# Altium project EEM_FMC_Carrier.PrjPCB (part 5 of 9)

## Sheet FPGA_SDRAM.SchDoc: EEM FMC Carrier
size 420 x 297 mm; EDA_Number: ARTIQ; Projet: ARTIQ/Sinara; CheckedBy: -; CompanyName: WUT ISE; DrawnBy: Paweł Kulik; Organization: WUT ISE; Address1: Warsaw University of Technology; Address2: Nowowiejska 15/19 00-665 Warsaw; Address3: pawel.kulik@pw.edu.pl; DocumentNumber: 14; SheetNumber: 5; SheetTotal: 13; ModifiedBy: -; CheckedDate: -; Title2: FPGA SDRAM; DivGrp: ISE; Designer: Paweł Kulik; ModifiedDate: -; ProjectName: EEM_FMC_Carrier.PrjPCB
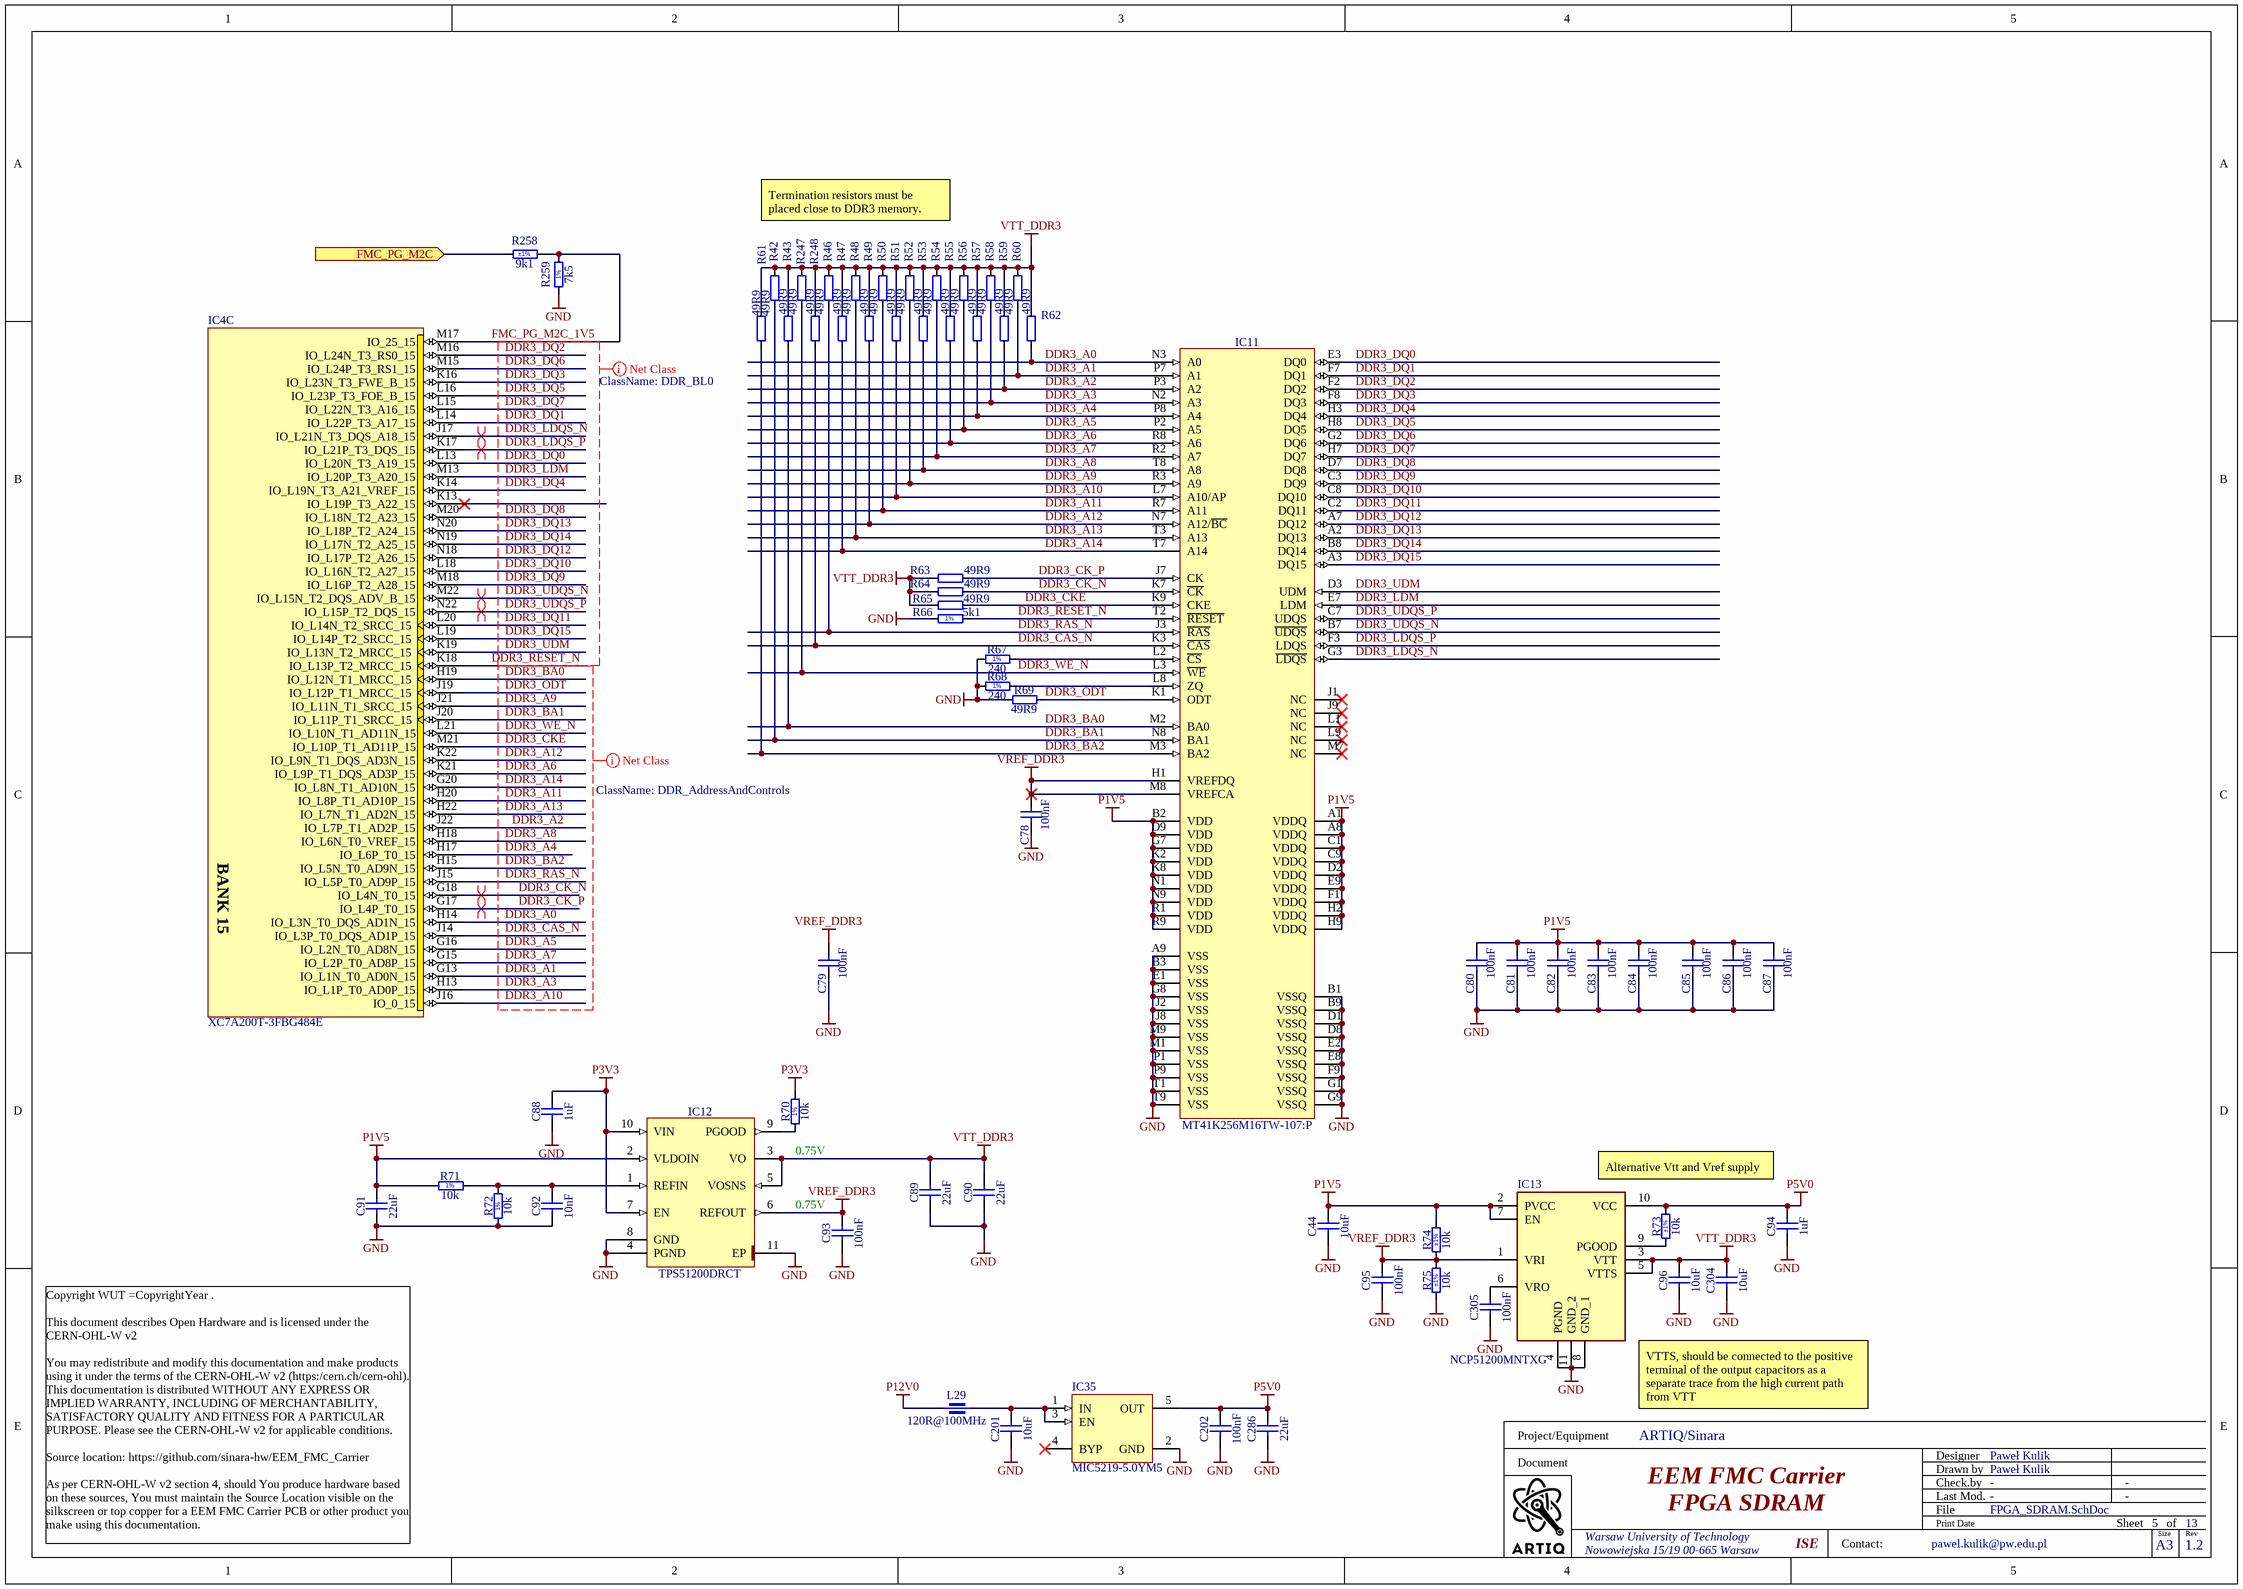
[diagram p7: FPGA_SDRAM.SchDoc]

### Parts
C44  10uF  [CAPC2012X95N]
C78  100nF  [CAPC0603X33N]
C79  100nF  [CAPC0603X33N]
C80  100nF  [CAPC0603X33N]
C81  100nF  [CAPC0603X33N]
C82  100nF  [CAPC0603X33N]
C83  100nF  [CAPC0603X33N]
C84  100nF  [CAPC0603X33N]
C85  100nF  [CAPC0603X33N]
C86  100nF  [CAPC0603X33N]
C87  100nF  [CAPC0603X33N]
C88  1uF  [CAPC1005X55N]
C89  22uF  [CAPC1608X90N]
C90  22uF  [CAPC1608X90N]
C91  22uF  [CAPC1608X90N]
C92  10nF  [CAPC1005X55N]
C93  100nF  [CAPC0603X33N]
C94  1uF  [CAPC1608X87N]
C95  100nF  [CAPC0603X33N]
C96  10uF  [CAPC2012X95N]
C201  10uF  [CAPC2012X95N]
C202  100nF  [CAPC0603X33N]
C286  22uF  [CAPC1608X90N]
C304  10uF  [CAPC2012X95N]
C305  100nF  [CAPC0603X33N]
IC4  XC7A200T-3FBG484E  [BGA484C100P22X22_2300X2300X254]  (part C of 10)
IC11  MT41K256M16TW-107:P  [BGA96C80P9X16_800X1400X120]
IC12  TPS51200DRCT  [TEXAS_DRC (S-PVSON-N10)]
IC13  NCP51200MNTXG  [SON50P300X300X100-11N]
IC35  MIC5219-5.0YM5  [SOT95P280X145-5N]
L29  120R@100MHz  [INDC1608X65N]
R42  49R9  [RESC1005X40N]
R43  49R9  [RESC1005X40N]
R46  49R9  [RESC1005X40N]
R47  49R9  [RESC1005X40N]
R48  49R9  [RESC1005X40N]
R49  49R9  [RESC1005X40N]
R50  49R9  [RESC1005X40N]
R51  49R9  [RESC1005X40N]
R52  49R9  [RESC1005X40N]
R53  49R9  [RESC1005X40N]
R54  49R9  [RESC1005X40N]
R55  49R9  [RESC1005X40N]
R56  49R9  [RESC1005X40N]
R57  49R9  [RESC1005X40N]
R58  49R9  [RESC1005X40N]
R59  49R9  [RESC1005X40N]
R60  49R9  [RESC1005X40N]
R61  49R9  [RESC1005X40N]
R62  49R9  [RESC1005X40N]
R63  49R9  [RESC1005X40N]
R64  49R9  [RESC1005X40N]
R65  49R9  [RESC1005X40N]
R66  5k1  [RESC1005X40N]
R67  240  [RESC1005X40N]
R68  240  [RESC1005X40N]
R69  49R9  [RESC1005X40N]
R70  10k  [RESC1005X40N]
R71  10k  [RESC1005X40N]
R72  10k  [RESC1005X40N]
R73  10k  Tolerance: ±1%  [RESC1005X40N]
R74  10k  Tolerance: ±1%  [RESC1005X40N]
R75  10k  Tolerance: ±1%  [RESC1005X40N]
R247  49R9  [RESC1005X40N]
R248  49R9  [RESC1005X40N]
R258  9k1  Tolerance: ±1%  [RESC1005X40N]
R259  7k5  [RESC1005X40N]

### Ports
FMC_PG_M2C (in)

### Nets
GND: C44.1 C78.1 C79.1 C80.1 C81.1 C82.1 C83.1 C84.1 C85.1 C86.1 C87.1 C88.1 C89.1 C90.1 C91.1 C92.1 C93.1 C94.1 C95.1 C96.1 C201.1 C202.1 C286.1 C304.1 C305.1 IC11.A9(VSS) IC11.B1(VSSQ) IC11.B3(VSS) IC11.B9(VSSQ) IC11.D1(VSSQ) IC11.D8(VSSQ) IC11.E1(VSS) IC11.E2(VSSQ) IC11.E8(VSSQ) IC11.F9(VSSQ) IC11.G1(VSSQ) IC11.G8(VSS) IC11.G9(VSSQ) IC11.J2(VSS) IC11.J8(VSS) IC11.M1(VSS) IC11.M9(VSS) IC11.P1(VSS) IC11.P9(VSS) IC11.T1(VSS) IC11.T9(VSS) IC12.4(PGND) IC12.8(GND) IC12.11(EP) IC13.4(PGND) IC13.8(GND_1) IC13.11(GND_2) IC35.2(GND) R66.1 R67.1 R68.1 R69.1 R72.1 R75.1 R259.1
P1V5: C44.2 C80.2 C81.2 C82.2 C83.2 C84.2 C85.2 C86.2 C87.2 C91.2 IC11.A1(VDDQ) IC11.A8(VDDQ) IC11.B2(VDD) IC11.C1(VDDQ) IC11.C9(VDDQ) IC11.D2(VDDQ) IC11.D9(VDD) IC11.E9(VDDQ) IC11.F1(VDDQ) IC11.G7(VDD) IC11.H2(VDDQ) IC11.H9(VDDQ) IC11.K2(VDD) IC11.K8(VDD) IC11.N1(VDD) IC11.N9(VDD) IC11.R1(VDD) IC11.R9(VDD) IC12.2(VLDOIN) IC13.2(PVCC) IC13.7(EN) R71.1 R74.2
P3V3: C88.2 IC12.7(EN) IC12.10(VIN) R70.2
P5V0: C94.2 C202.2 C286.2 IC13.10(VCC) IC35.5(OUT) R73.2
P12V0: L29.1
VREF_DDR3: C78.2 C79.2 C93.2 C95.2 IC11.H1(VREFDQ) IC11.M8(VREFCA) IC12.6(REFOUT) IC13.1(VRI) R74.1 R75.2
VTT_DDR3: C89.2 C90.2 C96.2 C304.2 IC12.3(VO) IC12.5(VOSNS) IC13.3(VTT) IC13.5(VTTS) R42.2 R43.2 R46.2 R47.2 R48.2 R49.2 R50.2 R51.2 R52.2 R53.2 R54.2 R55.2 R56.2 R57.2 R58.2 R59.2 R60.2 R61.2 R62.2 R63.1 R64.1 R65.1 R247.2 R248.2
DDR3_A0: IC4.H14(IO_L3N_T0_DQS_AD1N_15) IC11.N3(A0) R62.1
DDR3_A1: IC4.G13(IO_L1N_T0_AD0N_15) IC11.P7(A1) R60.1
DDR3_A2: IC4.J22(IO_L7P_T1_AD2P_15) IC11.P3(A2) R59.1
DDR3_A3: IC4.H13(IO_L1P_T0_AD0P_15) IC11.N2(A3) R58.1
DDR3_A4: IC4.H17(IO_L6P_T0_15) IC11.P8(A4) R57.1
DDR3_A5: IC4.G16(IO_L2N_T0_AD8N_15) IC11.P2(A5) R56.1
DDR3_A6: IC4.K21(IO_L9P_T1_DQS_AD3P_15) IC11.R8(A6) R55.1
DDR3_A7: IC4.G15(IO_L2P_T0_AD8P_15) IC11.R2(A7) R54.1
DDR3_A8: IC4.H18(IO_L6N_T0_VREF_15) IC11.T8(A8) R53.1
DDR3_A9: IC4.J21(IO_L11N_T1_SRCC_15) IC11.R3(A9) R52.1
DDR3_A10: IC4.J16(IO_0_15) IC11.L7(A10/AP) R51.1
DDR3_A11: IC4.H20(IO_L8P_T1_AD10P_15) IC11.R7(A11) R50.1
DDR3_A12: IC4.K22(IO_L9N_T1_DQS_AD3N_15) IC11.N7(A12/~{BC}) R49.1
DDR3_A13: IC4.H22(IO_L7N_T1_AD2N_15) IC11.T3(A13) R48.1
DDR3_A14: IC4.G20(IO_L8N_T1_AD10N_15) IC11.T7(A14) R47.1
DDR3_BA0: IC4.H19(IO_L12N_T1_MRCC_15) IC11.M2(BA0) R43.1
DDR3_BA1: IC4.J20(IO_L11P_T1_SRCC_15) IC11.N8(BA1) R42.1
DDR3_BA2: IC4.H15(IO_L5N_T0_AD9N_15) IC11.M3(BA2) R61.1
DDR3_CAS_N: IC4.J14(IO_L3P_T0_DQS_AD1P_15) IC11.K3(~{CAS}) R248.1
DDR3_CK_N: IC4.G18(IO_L4N_T0_15) IC11.K7(~{CK}) R64.2
DDR3_CK_P: IC4.G17(IO_L4P_T0_15) IC11.J7(CK) R63.2
DDR3_CKE: IC4.M21(IO_L10P_T1_AD11P_15) IC11.K9(CKE) R65.2
DDR3_DQ0: IC4.L13(IO_L20N_T3_A19_15) IC11.E3(DQ0)
DDR3_DQ1: IC4.L14(IO_L22P_T3_A17_15) IC11.F7(DQ1)
DDR3_DQ2: IC4.M16(IO_L24N_T3_RS0_15) IC11.F2(DQ2)
DDR3_DQ3: IC4.K16(IO_L23N_T3_FWE_B_15) IC11.F8(DQ3)
DDR3_DQ4: IC4.K14(IO_L19N_T3_A21_VREF_15) IC11.H3(DQ4)
DDR3_DQ5: IC4.L16(IO_L23P_T3_FOE_B_15) IC11.H8(DQ5)
DDR3_DQ6: IC4.M15(IO_L24P_T3_RS1_15) IC11.G2(DQ6)
DDR3_DQ7: IC4.L15(IO_L22N_T3_A16_15) IC11.H7(DQ7)
DDR3_DQ8: IC4.M20(IO_L18N_T2_A23_15) IC11.D7(DQ8)
DDR3_DQ9: IC4.M18(IO_L16P_T2_A28_15) IC11.C3(DQ9)
DDR3_DQ10: IC4.L18(IO_L16N_T2_A27_15) IC11.C8(DQ10)
DDR3_DQ11: IC4.L20(IO_L14N_T2_SRCC_15) IC11.C2(DQ11)
DDR3_DQ12: IC4.N18(IO_L17P_T2_A26_15) IC11.A7(DQ12)
DDR3_DQ13: IC4.N20(IO_L18P_T2_A24_15) IC11.A2(DQ13)
DDR3_DQ14: IC4.N19(IO_L17N_T2_A25_15) IC11.B8(DQ14)
DDR3_DQ15: IC4.L19(IO_L14P_T2_SRCC_15) IC11.A3(DQ15)
DDR3_LDM: IC4.M13(IO_L20P_T3_A20_15) IC11.E7(LDM)
DDR3_LDQS_N: IC4.J17(IO_L21N_T3_DQS_A18_15) IC11.G3(~{LDQS})
DDR3_LDQS_P: IC4.K17(IO_L21P_T3_DQS_15) IC11.F3(LDQS)
DDR3_ODT: IC4.J19(IO_L12P_T1_MRCC_15) IC11.K1(ODT) R69.2
DDR3_RAS_N: IC4.J15(IO_L5P_T0_AD9P_15) IC11.J3(~{RAS}) R46.1
DDR3_RESET_N: IC4.K18(IO_L13P_T2_MRCC_15) IC11.T2(~{RESET}) R66.2
DDR3_UDM: IC4.K19(IO_L13N_T2_MRCC_15) IC11.D3(UDM)
DDR3_UDQS_N: IC4.M22(IO_L15N_T2_DQS_ADV_B_15) IC11.B7(~{UDQS})
DDR3_UDQS_P: IC4.N22(IO_L15P_T2_DQS_15) IC11.C7(UDQS)
DDR3_WE_N: IC4.L21(IO_L10N_T1_AD11N_15) IC11.L3(~{WE}) R247.1
FMC_PG_M2C: R258.1 ; port FMC_PG_M2C
FMC_PG_M2C_1V5: IC4.M17(IO_25_15) R258.2 R259.2
NetC92_2: C92.2 IC12.1(REFIN) R71.2 R72.2
NetC201_2: C201.2 IC35.1(IN) IC35.3(EN) L29.2
NetC305_2: C305.2 IC13.6(VRO)
NetIC11_L2: IC11.L2(~{CS}) R67.2
NetIC11_L8: IC11.L8(ZQ) R68.2
NetIC12_9: IC12.9(PGOOD) R70.1
NetIC13_9: IC13.9(PGOOD) R73.1

Not connected (* = marked no-connect by the designer): IC4 K13(IO_L19P_T3_A22_15)*; IC11 J1(NC)* J9(NC)* L1(NC)* L9(NC)* M7(NC)*; IC35 4(BYP)*

### Layout directives
differential pair; differential pair class Diff_100Ohm; differential pair class Diff_100Ohm: DDR3_CK_N, DDR3_CK_P
differential pair; differential pair class Diff_100Ohm: DDR3_LDQS_N, DDR3_LDQS_P, DDR3_UDQS_N, DDR3_UDQS_P
net class DDR_AddressAndControls; net class 50Ohm: DDR3_A0, DDR3_A1, DDR3_A2, DDR3_A3, DDR3_A4, DDR3_A5, DDR3_A6, DDR3_A7, DDR3_A8, DDR3_A9, DDR3_A10, DDR3_A11, DDR3_A12, DDR3_A13, DDR3_A14, DDR3_BA0, DDR3_BA1, DDR3_BA2, DDR3_CAS_N, DDR3_CK_N, DDR3_CK_P, DDR3_CKE, DDR3_ODT, DDR3_RAS_N, DDR3_WE_N
net class DDR_BL0; net class 50Ohm: DDR3_DQ0, DDR3_DQ1, DDR3_DQ2, DDR3_DQ3, DDR3_DQ4, DDR3_DQ5, DDR3_DQ6, DDR3_DQ7, DDR3_DQ8, DDR3_DQ9, DDR3_DQ10, DDR3_DQ11, DDR3_DQ12, DDR3_DQ13, DDR3_DQ14, DDR3_DQ15, DDR3_LDM, DDR3_LDQS_N, DDR3_LDQS_P, DDR3_UDM, DDR3_UDQS_N, DDR3_UDQS_P

### Notes on the sheet
- Termination resistors must be placed close to DDR3 memory.
- (near R70) 0.75V
- (near C93) 0.75V
- Alternative Vtt and Vref supply
- (near IC13) VTTS, should be connected to the positive terminal of the output capacitors as a separate trace from the high current path from VTT
- Project/Equipment
- Document
- Designer
- Drawn by
- Check.by
- Copyright WUT =CopyrightYear .
  This document describes Open Hardware and is licensed under the CERN-OHL-W v2
  You may redistribute and modify this documentation and make products using it under the terms of the CERN-OHL-W v2 (https:/cern.ch/cern-ohl). This documentation is distributed WITHOUT ANY EXPRESS OR IMPLIED WARRANTY, INCLUDING OF MERCHANTABILITY, SATISFACTORY QUALITY AND FITNESS FOR A PARTICULAR PURPOSE. Please see the CERN-OHL-W v2 for applicable conditions.
  Source location: https://github.com/sinara-hw/EEM_FMC_Carrier
  As per CERN-OHL-W v2 section 4, should You produce hardware based on these sources, You must maintain the Source Location visible on the silkscreen or top copper for a EEM FMC Carrier PCB or other product you make using this documentation.
- Contact:
- File
- Last Mod.
- Print Date
- Sheet
- Size
- A3
- of
- Rev
- (in symbol R0402_5K1_1%_0.0625W_100PPM) 1%
- (in symbol R0402_7K5_1%_0.0625W_100PPM) 1%
- (in symbol R0402_10K_1%_0.0625W_100PPM) 1%
- (in symbol R0402_240R_1%_0.0625W_100PPM) 1%
- (in symbol XC7A200T-3FBG484E, part C) BANK 15

### Library data of the parts
C44 C96 C201 C304 = CC0805_10UF_25V_10%_X5R: Non-polarised capacitor; Part Description: SMD Multilayer Chip Ceramic Capacitor; Manufacturer: GENERIC; Manufacturer1 Part Number: GRM219R61E106KA12D; Voltage: 25V; TC: X5R; Tolerance: ±10%; Part Number: CC0805_10UF_25V_10%_X5R; Component Kind: Standard; Component Type: Standard; Pin Count: 2; Value: 10uF; Status: Preferred; Manufacturer Part Number: CC0805_10UF_25V_10%_X5R; Case: 0805; Mounted: Yes; Socket: No; SMD: Yes; Sense: No; Manufacturer1 Example: MURATA; Manufacturer1 ComponentHeight: 0.95mm; HelpURL: \\cern.ch\dfs\Applications\Altium\Datasheets\CC0805_X5R_MURATA_GRM.pdf; Author: CERN DEM JLC; CreateDate: 25.10.2012; LatestRevisionDate: 06.09.2016
C78-C87 C93 C95 C202 C305 = CC0201_100NF_6.3V_10%_X5R: Non-polarised capacitor; Part Description: SMD Multilayer Chip Ceramic Capacitor; Manufacturer: GENERIC; Manufacturer1 Part Number: 02016D104KAT2A; Voltage: 6.3V; TC: X5R; Tolerance: ±10%; Part Number: CC0201_100NF_6.3V_10%_X5R; Component Kind: Standard; Component Type: Standard; Pin Count: 2; Value: 100nF; Status: Not Recommended; Manufacturer Part Number: CC0201_100NF_6.3V_10%_X5R; Case: 0201; Mounted: Yes; Socket: No; SMD: Yes; Sense: No; Manufacturer1 Example: AVX; Manufacturer1 ComponentHeight: 0.33mm; HelpURL: \\cern.ch\dfs\Applications\Altium\Datasheets\CC0201_X5R_AVX.pdf; Author: CERN DEM JLC
  C78-C87: CreateDate: 2007-12-03; LatestRevisionDate: 2007-12-03
  C93 C95 C202 C305: CreateDate: 03.12.2007; LatestRevisionDate: 03.12.2007
C88 = CC0402_1UF_16V_10%_X5R: Non-polarised capacitor; Part Description: SMD Multilayer Chip Ceramic Capacitor; Manufacturer: GENERIC; Manufacturer1 Part Number: C1005X5R1C105KT; Voltage: 16V; TC: X5R; Tolerance: ±10%; Part Number: CC0402_1UF_16V_10%_X5R; Component Kind: Standard; Component Type: Standard; Pin Count: 2; Value: 1uF; Status: Preferred; Manufacturer Part Number: CC0402_1UF_16V_10%_X5R; Case: 0402; Mounted: Yes; Socket: No; SMD: Yes; Manufacturer1 Example: TDK; Manufacturer1 ComponentHeight: 0.55mm; HelpURL: \\cern.ch\dfs\Applications\Altium\Datasheets\CC0402_X5R_TDK_C.pdf; Author: CERN DEM JLC; CreateDate: 25.10.2012; LatestRevisionDate: 25.10.2012; Sense: No
C89-C91 C286 = CC0603_22UF_6.3V_20%_X5R: Non-polarised capacitor; Part Description: SMD Multilayer Chip Ceramic Capacitor; Manufacturer: GENERIC; Manufacturer1 Part Number: C1608X5R0J226M080; Voltage: 6.3V; TC: X5R; Tolerance: ±20%; Part Number: CC0603_22UF_6.3V_20%_X5R; Component Kind: Standard; Component Type: Standard; Pin Count: 2; Value: 22uF; Status: None; Manufacturer Part Number: CC0603_22UF_6.3V_20%_X5R; Case: 0603; Mounted: Yes; Socket: No; SMD: Yes; Manufacturer1 Example: TDK; Manufacturer1 ComponentHeight: 0.9mm; HelpURL: \\cern.ch\dfs\Applications\Altium\Datasheets\CC0603_X5R_TDK_C.pdf; Author: CERN DEM JLC; CreateDate: 16.12.2013; LatestRevisionDate: 03.12.2020; Sense: No
C92 = CC0402_10NF_16V_10%_X7R: Non-polarised capacitor; Part Description: SMD Multilayer Chip Ceramic Capacitor; Manufacturer: GENERIC; Manufacturer1 Part Number: 223878715636; Voltage: 16V; TC: X7R; Tolerance: ±10%; Part Number: CC0402_10NF_16V_10%_X7R; Component Kind: Standard; Component Type: Standard; Pin Count: 2; Value: 10nF; Status: Not Recommended; Manufacturer Part Number: CC0402_10NF_16V_10%_X7R; Case: 0402; Mounted: Yes; Socket: No; SMD: Yes; Manufacturer1 Example: PHYCOMP; Manufacturer1 ComponentHeight: 0.55mm; HelpURL: \\cern.ch\dfs\Applications\Altium\Datasheets\CC0402_X7R_PHYCOMP.pdf; Author: CERN DEM JLC; CreateDate: 03.12.2007; LatestRevisionDate: 03.12.2007; Sense: No
C94 = CC0603_1UF_25V_10%_X7R: Non-polarised capacitor; Part Description: SMD Multilayer Chip Ceramic Capacitor; Manufacturer: GENERIC; Manufacturer1 Part Number: GRM188R71E105KA12D; Voltage: 25V; TC: X7R; Tolerance: ±10%; Part Number: CC0603_1UF_25V_10%_X7R; Component Kind: Standard; Component Type: Standard; Pin Count: 2; Value: 1uF; Status: None; Manufacturer Part Number: CC0603_1UF_25V_10%_X7R; Case: 0603; Mounted: Yes; Socket: No; SMD: Yes; Sense: No; Manufacturer1 Example: MURATA; Manufacturer1 ComponentHeight: 0.9mm; HelpURL: \\cern.ch\dfs\Applications\Altium\Datasheets\CC0603_X7R_MURATA.pdf; Author: CERN DEM JLC; CreateDate: 18.01.2011; LatestRevisionDate: 18.01.2011
IC4 = XC7A200T-3FBG484E: Artix-7 FPGA, 285 User I/Os, 4 GTP, 484-Ball BGA, Pb-Free; Manufacturer Part Number: XC7A200T-3FBG484E; Device: XC7A200T-3FBG484E
IC11 = MT41K256M16TW-107:P: 32 Meg x 16 x 8 Banks DDR3L SDRAM; Part Description: +1.5V, 4Gb (32Meg x 16 x 8 banks) DDR3L SDRAM; Manufacturer: MICRON TECHNOLOGY; PressFit: No; Bonding: No; Part Number: MT41K256M16TW-107:P; Component Kind: Standard; Component Type: Standard; Device: MT41K256M16TW-107:P; PackageDescription: BGA 0.8mm, Pitch, Square 96 Pin, 9 Columns x 16 Rows, Body 14mm X 8mm X 1.2mm H; Manufacturer Part Number: MT41K256M16TW-107:P; Pin Count: 96; Case: BGA96; Mounted: Yes; Socket: No; SMD: Yes; Sense: No; ComponentHeight: 1.2mm; HelpURL: \\cern.ch\dfs\Applications\Altium\Datasheets\MT41K256M16TW-107-P.pdf; Author: CERN DEM MR; CreateDate: 2015-12-14; LatestRevisionDate: 2015-12-14
IC12 = TPS51200DRCT: Sink/Source DDR Termination Regulator; Part Description: 3.3V Sink/Source DDR Termination Regulator; Manufacturer: TEXAS INSTRUMENTS; PressFit: No; Bonding: No; Part Number: TPS51200DRCT; Component Kind: Standard; Component Type: Standard; Device: TPS51200DRCT; PackageDescription: SON, 0.50mm Pitch, 10-pin, 3.00mm W  X 3.00mm L X 1.00mm Height, (w/thermal tab 1.75 X 2.50 mm); Manufacturer Part Number: TPS51200DRCT; Pin Count: 11; Case: SON10; Mounted: Yes; Socket: No; SMD: Yes; Sense: No; ComponentHeight: 1mm; HelpURL: \\cern.ch\dfs\Applications\Altium\Datasheets\TPS51200DRCT.pdf; Author: CERN DEM JLC; CreateDate: 03.02.2010; LatestRevisionDate: 06.11.2013
IC13 = NCP51200MNTXG: Integrated Circuit; Manufacturer_Name: onsemi; Datasheet Link: http://www.onsemi.com/pub/Collateral/NCP51200-D.PDF; Height: 1mm; Mouser Part Number: 863-NCP51200MNTXG; Mouser Price/Stock: https://www.mouser.co.uk/ProductDetail/onsemi/NCP51200MNTXG?qs=mt7EBqA2jzgnxcGILBvARw%3D%3D; Arrow Part Number: NCP51200MNTXG; Arrow Price/Stock: https://www.arrow.com/en/products/ncp51200mntxg/on-semiconductor?region=nac; Manufacturer Part Number: NCP51200MNTXG
IC35 = MIC5219-5.0YM5: 500mA-Peak Output LDO Regulator 5.0V; Manufacturer: Microchip; Manufacturer Part Number: MIC5219-5.0YM5; Device: MIC5219-5.0YM5
L29 = IND0603_MURATA_BLM18SG121TN1D: Part Description: SMD EMIFIL Suppression Chip Ferrite Bead; Manufacturer: MURATA; Power: 3A; Resistance: 0.025R; Tolerance: ±25%; Part Number: IND0603_MURATA_BLM18SG121TN1D; Component Kind: Standard; Component Type: Standard; Pin Count: 2; Value: 120R@100MHz; Status: None; Manufacturer Part Number: BLM18SG121TN1D; Case: 0603; Mounted: Yes; Socket: No; SMD: Yes; Sense: No; ComponentHeight: 0.65mm; HelpURL: \\cern.ch\dfs\Applications\Altium\Datasheets\IND0603_MURATA_BLM18S.pdf; Author: CERN DEM JLC; CreateDate: 23.07.2014; LatestRevisionDate: 25.10.2018
R42 R43 R46-R65 R69 R247 R248 = R0402_49R9_1%_0.0625W_100PPM: Resistor - 1%; Part Description: General Purpose Thick Film Chip Resistor; Manufacturer: GENERIC; Manufacturer1 Part Number: 232270674999L or RC0402FR-0749R9L; TC: ±100ppm/°C; PressFit: No; Part Number: R0402_49R9_1%_0.0625W_100PPM; Component Kind: Standard; Component Type: Standard; Pin Count: 2; Value: 49R9; Status: Not Recommended; Power: 0.0625W; Tolerance: ±1%; Manufacturer Part Number: R0402_49R9_1%_0.0625W_100PPM; Case: 0402; Mounted: Yes; Socket: No; SMD: Yes; Manufacturer1 Example: YAGEO PHYCOMP; Manufacturer1 ComponentHeight: 0.4mm; HelpURL: \\cern.ch\dfs\Applications\Altium\Datasheets\R0402_Phycomp_RC0402.pdf; Author: CERN DEM JLC; CreateDate: 24.10.2012; LatestRevisionDate: 24.10.2012; Sense: No
R66 = R0402_5K1_1%_0.0625W_100PPM: Resistor - 1%; Part Description: General Purpose Thick Film Chip Resistor; Manufacturer: GENERIC; Manufacturer1 Part Number: 232270675102L; TC: ±100ppm/°C; PressFit: No; Part Number: R0402_5K1_1%_0.0625W_100PPM; Component Kind: Standard; Component Type: Standard; Pin Count: 2; Value: 5k1; Status: Not Recommended; Power: 0.0625W; Tolerance: ±1%; Manufacturer Part Number: R0402_5K1_1%_0.0625W_100PPM; Case: 0402; Mounted: Yes; Sense: No; Socket: No; SMD: Yes; Manufacturer1 Example: YAGEO PHYCOMP; Manufacturer1 ComponentHeight: 0.4mm; HelpURL: \\cern.ch\dfs\Applications\Altium\Datasheets\R0402_Phycomp_RC0402.pdf; Author: CERN DEM JLC; CreateDate: 03.12.2007; LatestRevisionDate: 17.10.2012
R67 R68 = R0402_240R_1%_0.0625W_100PPM: Resistor - 1%; Part Description: General Purpose Thick Film Chip Resistor; Manufacturer: GENERIC; Manufacturer1 Part Number: 232270672401L; TC: ±100ppm/°C; PressFit: No; Part Number: R0402_240R_1%_0.0625W_100PPM; Component Kind: Standard; Component Type: Standard; Pin Count: 2; Value: 240; Status: Not Recommended; Power: 0.0625W; Tolerance: ±1%; Manufacturer Part Number: R0402_240R_1%_0.0625W_100PPM; Case: 0402; Mounted: Yes; Sense: No; Socket: No; SMD: Yes; Manufacturer1 Example: YAGEO PHYCOMP; Manufacturer1 ComponentHeight: 0.4mm; HelpURL: \\cern.ch\dfs\Applications\Altium\Datasheets\R0402_Phycomp_RC0402.pdf; Author: CERN DEM JLC; CreateDate: 03.12.2007; LatestRevisionDate: 17.10.2012
R70-R75 = R0402_10K_1%_0.0625W_100PPM: Resistor - 1%; Part Description: General Purpose Thick Film Chip Resistor; Manufacturer: GENERIC; Manufacturer1 Part Number: 232270671003L; TC: ±100ppm/°C; PressFit: No; Part Number: R0402_10K_1%_0.0625W_100PPM; Component Kind: Standard; Component Type: Standard; Pin Count: 2; Value: 10k; Status: Not Recommended; Power: 0.0625W; Manufacturer Part Number: R0402_10K_1%_0.0625W_100PPM; Case: 0402; Mounted: Yes; Socket: No; SMD: Yes; Manufacturer1 Example: YAGEO PHYCOMP; Manufacturer1 ComponentHeight: 0.4mm; HelpURL: \\cern.ch\dfs\Applications\Altium\Datasheets\R0402_Phycomp_RC0402.pdf; Author: CERN DEM JLC; CreateDate: 03.12.2007; LatestRevisionDate: 17.10.2012; Sense: No
  R70-R72: Tolerance: ±1%
R258 = R0402_9K1_1%_0.0625W_100PPM: Resistor - 1%; Part Description: General Purpose Thick Film Chip Resistor; Manufacturer: GENERIC; Manufacturer1 Part Number: 232270679102L; TC: ±100ppm/°C; PressFit: No; Part Number: R0402_9K1_1%_0.0625W_100PPM; Component Kind: Standard; Component Type: Standard; Pin Count: 2; Value: 9k1; Status: Not Recommended; Power: 0.0625W; Manufacturer Part Number: R0402_9K1_1%_0.0625W_100PPM; Case: 0402; Mounted: Yes; Sense: No; Socket: No; SMD: Yes; Manufacturer1 Example: YAGEO PHYCOMP; Manufacturer1 ComponentHeight: 0.4mm; HelpURL: \\cern.ch\dfs\Applications\Altium\Datasheets\R0402_Phycomp_RC0402.pdf; Author: CERN DEM JLC; CreateDate: 2007-12-03; LatestRevisionDate: 2012-10-17
R259 = R0402_7K5_1%_0.0625W_100PPM: Resistor - 1%; Part Description: General Purpose Thick Film Chip Resistor; Manufacturer: GENERIC; Manufacturer1 Part Number: 232270677502L; TC: ±100ppm/°C; PressFit: No; Part Number: R0402_7K5_1%_0.0625W_100PPM; Component Kind: Standard; Component Type: Standard; Pin Count: 2; Value: 7k5; Status: Not Recommended; Power: 0.0625W; Tolerance: ±1%; Manufacturer Part Number: R0402_7K5_1%_0.0625W_100PPM; Case: 0402; Mounted: Yes; Sense: No; Socket: No; SMD: Yes; Manufacturer1 Example: YAGEO PHYCOMP; Manufacturer1 ComponentHeight: 0.4mm; HelpURL: \\cern.ch\dfs\Applications\Altium\Datasheets\R0402_Phycomp_RC0402.pdf; Author: CERN DEM JLC; CreateDate: 03.12.2007; LatestRevisionDate: 17.10.2012

## Sheet JTAG_Flash_Update.SchDoc: EEM FMC Carrier
size 420 x 297 mm; CheckedBy: -; CompanyName: WUT ISE; DrawnBy: Paweł Kulik; Organization: WUT ISE; Address1: Warsaw University of Technology; Address2: Nowowiejska 15/19 00-665 Warsaw; Address3: pawel.kulik@pw.edu.pl; DocumentNumber: 11; SheetNumber: 9; SheetTotal: 13; CheckedDate: -; Title2: JTAG, Flash & update interface; DivGrp: ISE; Designer: Paweł Kulik; EDA_Number: ARTIQ; Projet: ARTIQ/Sinara; ModifiedDate: -; ProjectName: EEM_FMC_Carrier.PrjPCB
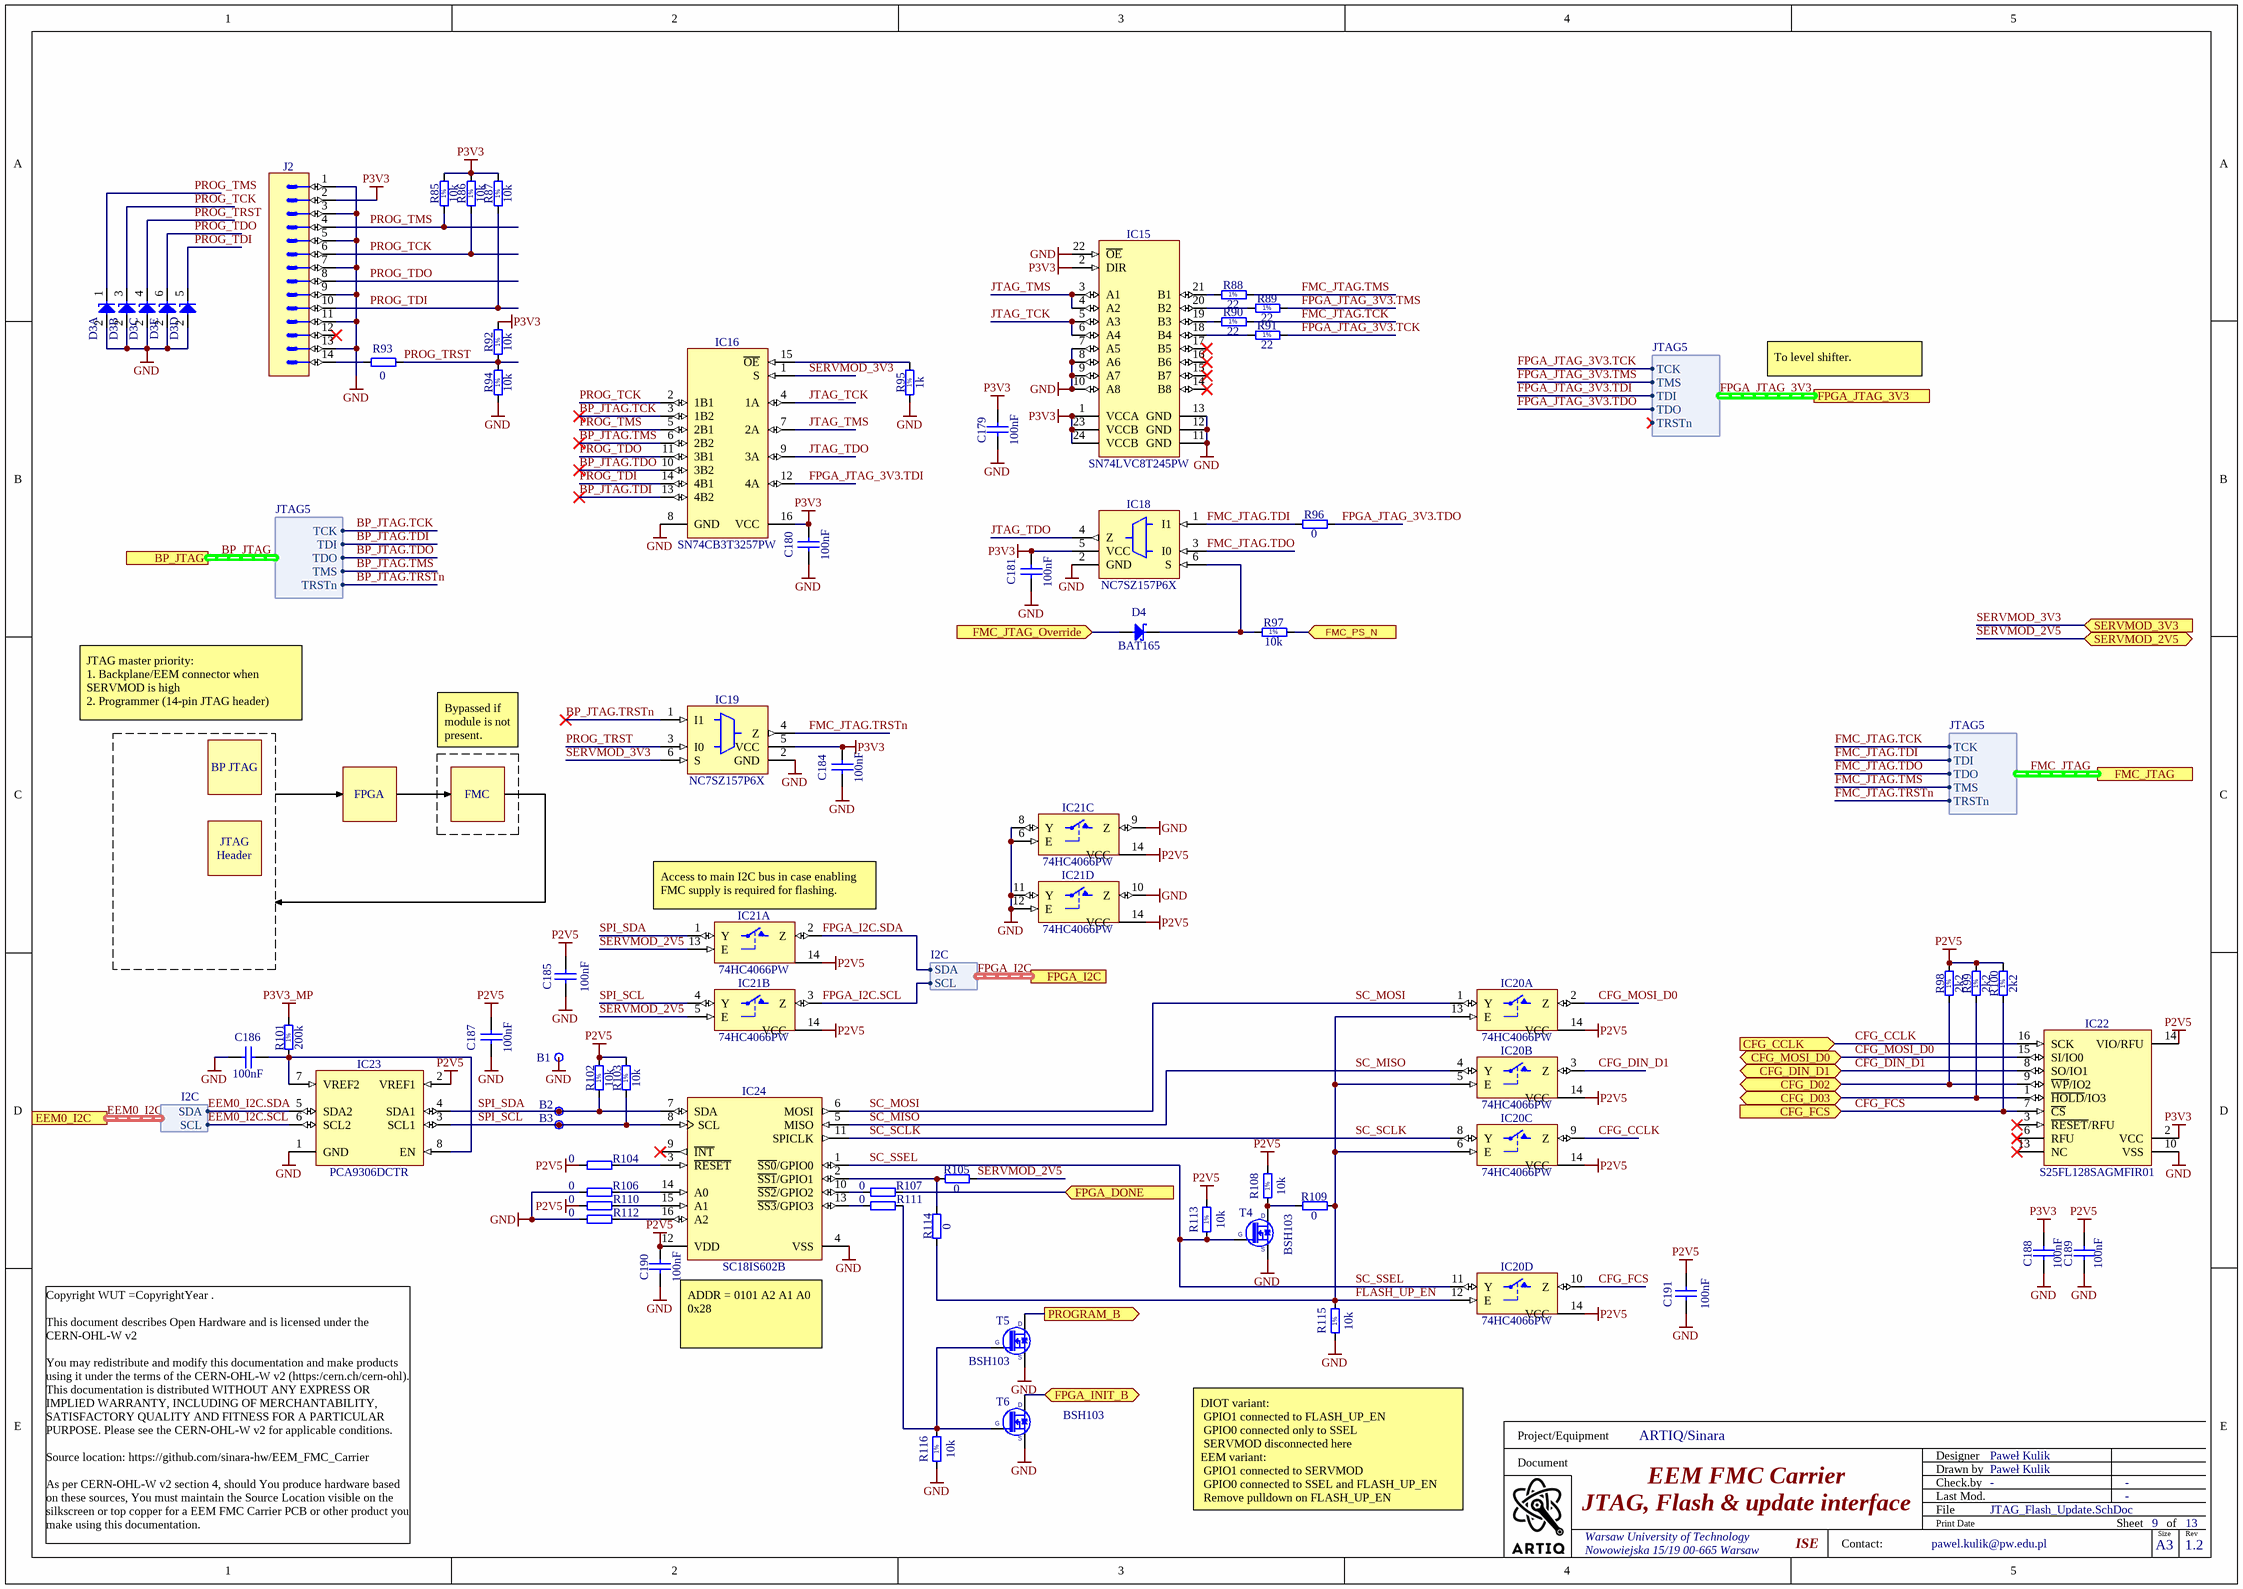
[diagram p8: JTAG_Flash_Update.SchDoc]

### Parts
B1  Plated Hole  [c150h100]  (value not drawn)  (no BOM)
B2  Test Point  [TPS127]  (value not drawn)  (no BOM)
B3  Test Point  [TPS127]  (value not drawn)  (no BOM)
C179  100nF  [CAPC1005X55N]
C180  100nF  [CAPC1005X55N]
C181  100nF  [CAPC1005X55N]
C184  100nF  [CAPC1005X55N]
C185  100nF  [CAPC1005X55N]
C186  100nF  [CAPC1005X55N]
C187  100nF  [CAPC1005X55N]
C188  100nF  [CAPC0603X33N]
C189  100nF  [CAPC0603X33N]
C190  100nF  [CAPC1005X55N]
C191  100nF  [CAPC1005X55N]
D3  PESD3V3L5UY  [SOT65P210X110-6N]  (value not drawn)  (parts A,B,C,D,E of 5)
D4  BAT165  [SOD2512X110N]
IC15  SN74LVC8T245PW  [SOP65P640X120-24N]
IC16  SN74CB3T3257PW  [SOP65P640X120-16N]
IC18  NC7SZ157P6X  [SOT65P210X110-6N]
IC19  NC7SZ157P6X  [SOT65P210X110-6N]
IC20  74HC4066PW  [SOP65P640X110-14N]  (parts A,B,C,D of 4)
IC21  74HC4066PW  [SOP65P640X110-14N]  (parts A,B,C,D of 4)
IC22  S25FL128SAGMFIR01  [SOIC127P1030X265-16N]
IC23  PCA9306DCTR  [SOP65P400X130-8N]
IC24  SC18IS602B  [SOP65P640X110-16N]
J2  Milli-Grid™  [MOLEX_87832-1420]  (value not drawn)
R85  10k  [RESC1005X40N]
R86  10k  [RESC1005X40N]
R87  10k  [RESC1005X40N]
R88  22  [RESC1005X40N]
R89  22  [RESC1005X40N]
R90  22  [RESC1005X40N]
R91  22  [RESC1005X40N]
R92  10k  [RESC1005X40N]
R93  0  [RESC1005X40N]
R94  10k  [RESC1005X40N]
R95  1k  [RESC1005X40N]
R96  0  [RESC1005X40N]
R97  10k  [RESC1005X40N]
R98  2k2  [RESC1005X40N]
R99  2k2  [RESC1005X40N]
R100  2k2  [RESC1005X40N]
R101  200k  [RESC1005X40N]
R102  10k  [RESC1005X40N]
R103  10k  [RESC1005X40N]
R104  0  [RESC1005X40N]
R105  0  [RESC1005X40N]
R106  0  [RESC1005X40N]
R107  0  [RESC1005X40N]
R108  10k  [RESC1005X40N]
R109  0  [RESC1005X40N]
R110  0  [RESC1005X40N]
R111  0  [RESC1005X40N]
R112  0  [RESC1005X40N]
R113  10k  [RESC1005X40N]
R114  0  [RESC1005X40N]
R115  10k  [RESC1005X40N]
R116  10k  [RESC1005X40N]
T4  BSH103  [SOT95P230X110-3N]
T5  BSH103  [SOT95P230X110-3N]
T6  BSH103  [SOT95P230X110-3N]

### Ports
BP_JTAG (harness JTAG5), CFG_CCLK (in), CFG_D02 (bidir), CFG_D03 (bidir), CFG_DIN_D1 (bidir), CFG_FCS (in), CFG_MOSI_D0 (bidir), EEM0_I2C (harness I2C), FMC_JTAG (harness JTAG5), FMC_JTAG_Override (in), FMC_PS_N (in), FPGA_DONE (in), FPGA_I2C (harness I2C), FPGA_INIT_B (bidir), FPGA_JTAG_3V3 (harness JTAG5), PROGRAM_B (out), SERVMOD_2V5 (bidir), SERVMOD_3V3 (in)

### Harnesses
JTAG5: TCK, TDI, TDO, TMS, TRSTn
I2C: SDA, SCL

### Nets
GND: B1.1 C179.1 C180.1 C181.1 C184.1 C185.1 C186.1 C187.1 C188.1 C189.1 C190.1 C191.1 D3.2(A) IC15.7(A5) IC15.8(A6) IC15.9(A7) IC15.10(A8) IC15.11(GND) IC15.12(GND) IC15.13(GND) IC15.22(~{OE}) IC16.8(GND) IC18.2(GND) IC19.2(GND) IC20.7(GND) IC21.6(E) IC21.7(GND) IC21.8(Y) IC21.9(Z) IC21.10(Z) IC21.11(Y) IC21.12(E) IC22.10(VSS) IC23.1(GND) IC24.4(VSS) J2.1 J2.3 J2.5 J2.7 J2.9 J2.11 J2.13 R94.1 R95.1 R106.2 R112.2 R115.1 R116.1 T4.2(S) T5.2(S) T6.2(S)
P2V5: C185.2 C187.2 C189.2 C190.2 C191.2 IC20.14(VCC) IC21.14(VCC) IC22.14(VIO/RFU) IC23.2(VREF1) IC24.12(VDD) R98.2 R99.2 R100.2 R102.2 R103.2 R104.2 R108.2 R110.2 R113.2
P3V3: C179.2 C180.2 C181.2 C184.2 C188.2 IC15.1(VCCA) IC15.2(DIR) IC15.23(VCCB) IC15.24(VCCB) IC16.16(VCC) IC18.5(VCC) IC19.5(VCC) IC22.2(VCC) J2.2 R85.2 R86.2 R87.2 R92.2
P3V3_MP: R101.2
BP_JTAG.TCK: IC16.3(1B2) ; port BP_JTAG.TCK
BP_JTAG.TDI: IC16.13(4B2) ; port BP_JTAG.TDI
BP_JTAG.TDO: IC16.10(3B2) ; port BP_JTAG.TDO
BP_JTAG.TMS: IC16.6(2B2) ; port BP_JTAG.TMS
BP_JTAG.TRSTn: IC19.1(I1) ; port BP_JTAG.TRSTn
CFG_CCLK: IC20.9(Z) IC22.16(SCK) ; port CFG_CCLK
CFG_D02: IC22.9(~{WP}/IO2) R98.1 ; port CFG_D02
CFG_D03: IC22.1(~{HOLD}/IO3) R99.1 ; port CFG_D03
CFG_DIN_D1: IC20.3(Z) IC22.8(SO/IO1) ; port CFG_DIN_D1
CFG_FCS: IC20.10(Z) IC22.7(~{CS}) R100.1 ; port CFG_FCS
CFG_MOSI_D0: IC20.2(Z) IC22.15(SI/IO0) ; port CFG_MOSI_D0
EEM0_I2C.SCL: IC23.6(SCL2) ; port EEM0_I2C.SCL
EEM0_I2C.SDA: IC23.5(SDA2) ; port EEM0_I2C.SDA
FLASH_UP_EN: IC20.5(E) IC20.6(E) IC20.12(E) IC20.13(E) R109.2 R114.1 R115.2
FMC_JTAG.TCK: R90.2 ; port FMC_JTAG.TCK
FMC_JTAG.TDI: IC18.1(I1) R96.2 ; port FMC_JTAG.TDI
FMC_JTAG.TDO: IC18.3(I0) ; port FMC_JTAG.TDO
FMC_JTAG.TMS: R88.2 ; port FMC_JTAG.TMS
FMC_JTAG.TRSTn: IC19.4(Z) ; port FMC_JTAG.TRSTn
FMC_JTAG_Override: D4.2(A) ; port FMC_JTAG_Override
FMC_PS_N: R97.2 ; port FMC_PS_N
FPGA_DONE: R107.1 ; port FPGA_DONE
FPGA_I2C.SCL: IC21.3(Z) ; port FPGA_I2C.SCL
FPGA_I2C.SDA: IC21.2(Z) ; port FPGA_I2C.SDA
FPGA_INIT_B: T6.3(D) ; port FPGA_INIT_B
FPGA_JTAG_3V3.TCK: R91.2 ; port FPGA_JTAG_3V3.TCK
FPGA_JTAG_3V3.TDI: IC16.12(4A) ; port FPGA_JTAG_3V3.TDI
FPGA_JTAG_3V3.TDO: R96.1 ; port FPGA_JTAG_3V3.TDO
FPGA_JTAG_3V3.TMS: R89.2 ; port FPGA_JTAG_3V3.TMS
JTAG_TCK: IC15.5(A3) IC15.6(A4) IC16.4(1A)
JTAG_TDO: IC16.9(3A) IC18.4(Z)
JTAG_TMS: IC15.3(A1) IC15.4(A2) IC16.7(2A)
PROG_TCK: D3.3(C) IC16.2(1B1) J2.6 R86.1
PROG_TDI: D3.5(C) IC16.14(4B1) J2.10 R87.1
PROG_TDO: D3.6(C) IC16.11(3B1) J2.8
PROG_TMS: D3.1(C) IC16.5(2B1) J2.4 R85.1
PROG_TRST: D3.4(C) IC19.3(I0) R92.1 R93.1 R94.2
PROGRAM_B: T5.3(D) ; port PROGRAM_B
SC_MISO: IC20.4(Y) IC24.5(MISO)
SC_MOSI: IC20.1(Y) IC24.6(MOSI)
SC_SCLK: IC20.8(Y) IC24.11(SPICLK)
SC_SSEL: IC20.11(Y) IC24.1(~{SS0}/GPIO0) R113.1 T4.1(G)
SERVMOD_2V5: IC21.5(E) IC21.13(E) R105.2 ; port SERVMOD_2V5
SERVMOD_3V3: IC16.1(S) IC19.6(S) ; port SERVMOD_3V3
SPI_SCL: B3.1 IC21.4(Y) IC23.3(SCL1) IC24.8(SCL) R103.1
SPI_SDA: B2.1 IC21.1(Y) IC23.4(SDA1) IC24.7(SDA) R102.1
NetC186_2: C186.2 IC23.7(VREF2) IC23.8(EN) R101.1
NetD4_1: D4.1(C) IC18.6(S) R97.1
NetIC15_18: IC15.18(B4) R91.1
NetIC15_19: IC15.19(B3) R90.1
NetIC15_20: IC15.20(B2) R89.1
NetIC15_21: IC15.21(B1) R88.1
NetIC16_15: IC16.15(~{OE}) R95.2
NetIC24_2: IC24.2(~{SS1}/GPIO1) R105.1 R114.2
NetIC24_3: IC24.3(~{RESET}) R104.1
NetIC24_10: IC24.10(~{SS2}/GPIO2) R107.2
NetIC24_13: IC24.13(~{SS3}/GPIO3) R111.2
NetIC24_14: IC24.14(A0) R106.1
NetIC24_15: IC24.15(A1) R110.1
NetIC24_16: IC24.16(A2) R112.1
NetJ2_14: J2.14 R93.2
NetR108_1: R108.1 R109.1 T4.3(D)
NetR111_1: R111.1 R116.2 T5.1(G) T6.1(G)

Not connected (* = marked no-connect by the designer): IC15 14(B8)* 15(B7)* 16(B6)* 17(B5)*; IC22 3(~{RESET}/RFU)* 6(RFU)* 13(NC)*; IC24 9(~{INT})*; J2 12*

### Buses and harness runs
harness BP_JTAG = port BP_JTAG
harness EEM0_I2C = port EEM0_I2C
harness FMC_JTAG = port FMC_JTAG
harness FPGA_I2C = port FPGA_I2C
harness FPGA_JTAG_3V3 = port FPGA_JTAG_3V3

### Notes on the sheet
- To level shifter.
- JTAG master priority:
  1. Backplane/EEM connector when SERVMOD is high
  2. Programmer (14-pin JTAG header)
- BP JTAG
- FPGA
- Bypassed if module is not present.
- FMC
- JTAG
- Header
- (near IC21) Access to main I2C bus in case enabling FMC supply is required for flashing.
- ADDR = 0101 A2 A1 A0
  0x28
- DIOT variant:
  GPIO1 connected to FLASH_UP_EN
  GPIO0 connected only to SSEL
  SERVMOD disconnected here
  EEM variant:
  GPIO1 connected to SERVMOD
  GPIO0 connected to SSEL and FLASH_UP_EN
  Remove pulldown on FLASH_UP_EN
- Project/Equipment
- Document
- Designer
- Drawn by
- Check.by
- Copyright WUT =CopyrightYear .
  This document describes Open Hardware and is licensed under the CERN-OHL-W v2
  You may redistribute and modify this documentation and make products using it under the terms of the CERN-OHL-W v2 (https:/cern.ch/cern-ohl). This documentation is distributed WITHOUT ANY EXPRESS OR IMPLIED WARRANTY, INCLUDING OF MERCHANTABILITY, SATISFACTORY QUALITY AND FITNESS FOR A PARTICULAR PURPOSE. Please see the CERN-OHL-W v2 for applicable conditions.
  Source location: https://github.com/sinara-hw/EEM_FMC_Carrier
  As per CERN-OHL-W v2 section 4, should You produce hardware based on these sources, You must maintain the Source Location visible on the silkscreen or top copper for a EEM FMC Carrier PCB or other product you make using this documentation.
- Contact:
- File
- Last Mod.
- Print Date
- Sheet
- Size
- A3
- of
- Rev
- (in symbol R0402_1K_1%_0.0625W_100PPM) 1%
- (in symbol R0402_2K2_1%_0.0625W_100PPM) 1%
- (in symbol R0402_10K_1%_0.0625W_100PPM) 1%
- (in symbol R0402_22R_1%_0.0625W_100PPM) 1%
- (in symbol R0402_200K_1%_0.0625W_100PPM) 1%

### Library data of the parts
B1 = PLATED_HOLE1.0_PAD1.5: Single Terminal Socket; Part Description: Plated Through Hole: Hole Dia.=1mm Pad Dia.=1.5mm,  IPC-7251 Level C; Mounted: No; Part Number: PLATED_HOLE1.0_PAD1.5; Component Type: Standard (No BOM); Pin Count: 1; Family: Plated Hole; Socket: No; SMD: No; Sense: No; Status: None; ComponentHeight: 0mm; HelpURL: Undefined; Author: CERN DEM JLC; CreateDate: 30.10.2008; LatestRevisionDate: 30.10.2008; PackageDescription: Plated Through Hole: Hole Dia.=1mm Pad Dia.=1.5mm,  IPC-7251 Level C
B2 B3 = SMD_PAD_1.27X1.27MM: Part Description: 1.27mm x 1.27mm PCB Copper Area (SMD Test Point); Mounted: No; Part Number: SMD_PAD_1.27X1.27MM; Component Type: Standard (No BOM); Pin Count: 1; Family: Test Point; Socket: No; SMD: No; Sense: No; Status: None; ComponentHeight: 0mm; HelpURL: Undefined; Author: CERN DEM JLC; CreateDate: 12.01.2008; LatestRevisionDate: 12.01.2008; PackageDescription: 1.27mm x 1.27mm PCB Copper Area (SMD Test Point)
C179-C181 C184 C186 C187 = CC0402_100NF_25V_10%_X7R_YUDEN_TMK105B7104KVHF: Non-polarised capacitor; Part Description: SMD Multilayer Chip Ceramic Capacitor (High Dielectric Type) for Automotive / Industrial Applications; Manufacturer: TAIYO YUDEN; Voltage: 25V; TC: X7R; Tolerance: ±10%; Part Number: CC0402_100NF_25V_10%_X7R_YUDEN_TMK105B7104KVHF; Component Kind: Standard; Component Type: Standard; Pin Count: 2; Value: 100nF; Status: Not Recommended; Manufacturer Part Number: TMK105B7104KVHF; Case: 0402; Mounted: Yes; Socket: No; SMD: Yes; Sense: No; HelpURL: \\cern.ch\dfs\Applications\Altium\Datasheets\CC0402_TAIYO-YUDEN_TMK105B7104KVHF.pdf; Author: CERN DEM JLC; CreateDate: 10-May-17; LatestRevisionDate: 10-May-17; ComponentHeight: 0.55mm
C185 C190 C191 = CC0402_100NF_16V_10%_X5R: Non-polarised capacitor; Part Description: SMD Multilayer Chip Ceramic Capacitor; Manufacturer: GENERIC; Manufacturer1 Part Number: GRM155R61C104KA88D; Voltage: 16V; TC: X5R; Tolerance: ±10%; Part Number: CC0402_100NF_16V_10%_X5R; Component Kind: Standard; Component Type: Standard; Pin Count: 2; Value: 100nF; Status: None; Manufacturer Part Number: CC0402_100NF_16V_10%_X5R; Case: 0402; Mounted: Yes; Socket: No; SMD: Yes; Sense: No; Manufacturer1 Example: MURATA; Manufacturer1 ComponentHeight: 0.55mm; HelpURL: \\cern.ch\dfs\Applications\Altium\Datasheets\CC0402_X5R_MURATA_GRM.pdf; Author: CERN DEM JLC; CreateDate: 10.12.2013; LatestRevisionDate: 10.12.2013
C188 C189 = CC0201_100NF_6.3V_10%_X5R: as C78-C87 on sheet FPGA_SDRAM; Part Number: CC0201_100NF_6.3V_10%_X5R; Component Kind: Standard; Component Type: Standard; Pin Count: 2; Value: 100nF; Status: Not Recommended; Manufacturer Part Number: CC0201_100NF_6.3V_10%_X5R; Case: 0201; Mounted: Yes; Socket: No; SMD: Yes; Sense: No; Manufacturer1 Example: AVX; Manufacturer1 ComponentHeight: 0.33mm; HelpURL: \\cern.ch\dfs\Applications\Altium\Datasheets\CC0201_X5R_AVX.pdf; Author: CERN DEM JLC; CreateDate: 03.12.2007; LatestRevisionDate: 03.12.2007; ClassName: Artix
D3 = PESD3V3L5UY: Fivefold ESD Protection Diode Arrays; Part Description: Fivefold ESD Protection Diode Arrays (30kV); Manufacturer: NEXPERIA; Voltage: 3.3V; Power: 200W; PressFit: No; Bonding: No; Part Number: PESD3V3L5UY; Component Kind: Standard; Component Type: Standard; Device: PESD3V3L5UY; PackageDescription: SOT363, SC-88, 0.65mm Pitch; 6 Pin, 1.25mm W X 2.00mm L X 1.10mm H body, IPC Medium Density; Manufacturer Part Number: PESD3V3L5UY; Pin Count: 6; Case: SOT363; Mounted: Yes; Socket: No; SMD: Yes; Sense: No; ComponentHeight: 1.1mm; HelpURL: \\cern.ch\dfs\Applications\Altium\Datasheets\PESD3V3L5UY.pdf; Author: CERN DEM WB; CreateDate: 05.07.2021; LatestRevisionDate: 05.07.2021
D4 = BAT165: Schottky Diode; Manufacturer: INFINEON; Part Description: Medium Power AF Schottky Diode; Voltage: 40V; Power: 750mA; PressFit: No; Bonding: No; Manufacturer Part Number: BAT165; PackageDescription: Small Outline Diode (SOD-323), 1.70mm W X 1.25mm L X 1.10mm H body,  IPC Medium Density; Part Number: BAT165; Component Kind: Standard; Component Type: Standard; Device: BAT165; Pin Count: 2; Case: SOD323; Mounted: Yes; Socket: No; SMD: Yes; Sense: No; ComponentHeight: 1.1mm; HelpURL: \\cern.ch\dfs\Applications\Altium\Datasheets\BAT165.pdf; Author: CERN DEM JLC; CreateDate: 12.11.2014; LatestRevisionDate: 12.11.2014
IC15 = SN74LVC8T245PW: 8-Bit Dual-Supply Bus Transceiver With Configurable Voltage Translation and 3-State Outputs; Manufacturer: TEXAS INSTRUMENTS; PressFit: No; Bonding: No; Part Number: SN74LVC8T245PW; Component Kind: Standard; Component Type: Standard; Device: SN74LVC8T245PW; PackageDescription: SOP, 0.65mm Pitch; 24 Pin, 4.40mm W X 7.80mm L X 1.20mm H Body, IPC Medium Density; Part Description: 8-Bit Dual-Supply Bus Transceiver With Configurable Voltage Translation and 3-State Outputs; Manufacturer Part Number: SN74LVC8T245PW; Pin Count: 24; Case: TSSOP24; Mounted: Yes; Socket: No; SMD: Yes; Sense: No; ComponentHeight: 1.2mm; Author: CERN DEM JLC; HelpURL: \\cern.ch\dfs\Applications\Altium\Datasheets\SN74LVC8T245PW.pdf; CreateDate: 02.09.2009; LatestRevisionDate: 02.09.2009
IC16 = SN74CB3T3257PW: 4-BIT 1-OF-2 FET Multiplexer/Demultiplexer 2.5V/3.3V Low-Voltage Bus Switch 5V Tolerant Shifter; Manufacturer: TEXAS INSTRUMENTS; PressFit: No; Bonding: No; Part Number: SN74CB3T3257PW; Component Kind: Standard; Component Type: Standard; Device: SN74CB3T3257PW; PackageDescription: SOP, 0.65mm Pitch; 16 Pin, 4.40mm W X 5.00mm L X 1.20mm H body, IPC Medium Density; Part Description: 4-Bit 1-of-2 FET Multiplexer/Demultiplexer 2.5V/3.3V Low-Voltage Bus Switch 5V Tolerant Shifter; Manufacturer Part Number: SN74CB3T3257PW; Pin Count: 16; Case: TSSOP16; Mounted: Yes; Socket: No; SMD: Yes; Sense: No; ComponentHeight: 1.2mm; Author: CERN DEM JLC; HelpURL: \\cern.ch\dfs\Applications\Altium\Datasheets\SN74CB3T3257PW.pdf; CreateDate: 2012-01-30; LatestRevisionDate: 2012-01-30
IC18 IC19 = NC7SZ157P6X: TinyLogic® UHS 2-Input Non-Inverting Multiplexer; Manufacturer: FAIRCHILD SEMICONDUCTOR; PressFit: No; Bonding: No; Manufacturer Part Number: NC7SZ157P6X; PackageDescription: SOT363, 0.65mm pitch; 6 pin, 1.40mm W X 2.15mm L, IPC Medium Density; Part Description: TinyLogic® UHS 2-Input Non-Inverting Multiplexer; Part Number: NC7SZ157P6X; Component Kind: Standard; Component Type: Standard; Device: NC7SZ157P6X; Pin Count: 6; Case: SOT363; Mounted: Yes; Socket: No; SMD: Yes; Sense: No; ComponentHeight: 1.1mm; Author: CERN DEM JLC; HelpURL: \\cern.ch\dfs\Applications\Altium\Datasheets\NC7SZ157P6X.pdf; CreateDate: 22.03.2012; LatestRevisionDate: 22.03.2012
IC20 IC21 = 74HC4066PW: Part Description: Quad Single-Pole Single-Throw Analog Switch; Manufacturer: NXP SEMICONDUCTORS; PressFit: No; Bonding: No; Table: Standard Logic; Part Number: 74HC4066PW; Component Kind: Standard; Component Type: Standard; Device: 74HC4066PW; PackageDescription: SOP, 14-Leads, Body 4.4x5mm (max), Pitch 0.65mm, IPC Medium Density; Manufacturer Part Number: 74HC4066PW; Pin Count: 14; Case: TSSOP14; Mounted: Yes; Socket: No; SMD: Yes; ComponentHeight: 1.1mm; Author: CERN DEM JLC; HelpURL: \\cern.ch\dfs\Applications\Altium\Datasheets\74HC4066PW.pdf; CreateDate: 2014-11-19; LatestRevisionDate: 2014-11-19
IC22 = S25FL128SAGMFIR01: 128Mbit, MirrorBit® Flash Non-Volatile Memory CMOS 3.0 Volt Core with Versatile I/O Serial Peripheral Interface with Multi-I/O; Part Description: 128Mbit, 133MHz, MirrorBit® Flash Non-Volatile Memory CMOS 3V Core with Versatile I/O Serial Peripheral Interface with Multi-I/O; Manufacturer: SPANSION; PressFit: No; Bonding: No; Part Number: S25FL128SAGMFIR01; Component Kind: Standard; Component Type: Standard; Device: S25FL128SAGMFIR01; PackageDescription: SOIC 16, Pitch 1.27mm - Body 7.5x10.3mm, IPC Medium Density; Manufacturer Part Number: S25FL128SAGMFIR01; Pin Count: 11; Case: SOIC16; Mounted: Yes; Socket: No; SMD: Yes; Sense: No; ComponentHeight: 2.65mm; HelpURL: \\cern.ch\dfs\Applications\Altium\Datasheets\S25FL128SAGMFIR01.pdf; Author: CERN DEM JLC; CreateDate: 2014-07-10; LatestRevisionDate: 2014-07-10
IC23 = PCA9306DCTR: Dual Bidirectional I2C Bus And SMBus Voltage-Level Translator; Manufacturer: TEXAS INSTRUMENTS; PressFit: No; Bonding: No; Part Number: PCA9306DCTR; Component Kind: Standard; Component Type: Standard; Device: PCA9306DCTR; PackageDescription: SOP, 0.65mm, Pitch; 8 Pin, 2.80mm W X 2.95mm L X 1.30mm H Body, PC Medium Density; Part Description: Dual Bidirectional I2C Bus And SMBus Voltage-Level Translator; Manufacturer Part Number: PCA9306DCTR; Pin Count: 8; Case: SSOP8; Mounted: Yes; Socket: No; SMD: Yes; Sense: No; ComponentHeight: 1.3mm; Author: CERN DEM JLC; HelpURL: \\cern.ch\dfs\Applications\Altium\Datasheets\PCA9306DCTR.pdf; CreateDate: 25.02.2013; LatestRevisionDate: 11.02.2016
IC24 = SC18IS602B: I2C-bus to SPI bridge; Manufacturer: NXP SEMICONDUCTORS; PressFit: No; Bonding: No; Part Number: SC18IS602B; Component Kind: Standard; Component Type: Standard; Device: SC18IS602B; PackageDescription: SOP, 0.65mm pitch; 16 pin, 4.40mm W X 5.00mm L X 1.10mm H body IPC Medium Density; Part Description: I2C-Bus to SPI Bridge; Manufacturer Part Number: SC18IS602B; Pin Count: 16; Case: TSSOP16; Mounted: Yes; Socket: No; SMD: Yes; Sense: No; ComponentHeight: 1.1mm; HelpURL: \\cern.ch\dfs\Applications\Altium\Datasheets\SC18IS602B.pdf; Author: CERN DEM MR; CreateDate: 14/12/2015; LatestRevisionDate: 14/12/2015
J2 = MOLEX_87832-1420: Connector 14 Male; Part Description: 2.00mm (.079") Pitch Milli-Grid™ Header, Surface Mount, Vertical, Shrouded, 14 Circuits,with Locking Windows and Centre Polarization Slot, PCB Locator; Manufacturer: MOLEX; PressFit: No; Part Number: MOLEX_87832-1420; Component Kind: Standard; Component Type: Standard; Pin Count: 14; Family: Milli-Grid™; Mounted: Yes; Socket: No; SMD: Yes; Sense: No; Status: None; Manufacturer Part Number: 87832-1420; ComponentHeight: 7.6mm; HelpURL: \\cern.ch\dfs\Applications\Altium\Datasheets\MOLEX_87832-1420.pdf; Author: CERN DEM JLC; CreateDate: 09.09.2008; LatestRevisionDate: 09.09.2008
R85-R87 R92 R94 R102 R103 = R0402_10K_1%_0.0625W_100PPM: as R70-R75 on sheet FPGA_SDRAM; Part Number: R0402_10K_1%_0.0625W_100PPM; Component Kind: Standard; Component Type: Standard; Pin Count: 2; Value: 10k; Status: Not Recommended; Power: 0.0625W; Tolerance: ±1%; Manufacturer Part Number: R0402_10K_1%_0.0625W_100PPM; Case: 0402; Mounted: Yes; Sense: No; Socket: No; SMD: Yes; Manufacturer1 Example: YAGEO PHYCOMP; Manufacturer1 ComponentHeight: 0.4mm; HelpURL: \\cern.ch\dfs\Applications\Altium\Datasheets\R0402_Phycomp_RC0402.pdf; Author: CERN DEM JLC; CreateDate: 2007-12-03; LatestRevisionDate: 2012-10-17
R88-R91 = R0402_22R_1%_0.0625W_100PPM: Resistor - 1%; Part Description: General Purpose Thick Film Chip Resistor; Manufacturer: GENERIC; Manufacturer1 Part Number: 232270672209L; TC: ±100ppm/°C; PressFit: No; Part Number: R0402_22R_1%_0.0625W_100PPM; Component Kind: Standard; Component Type: Standard; Pin Count: 2; Value: 22; Status: Not Recommended; Power: 0.0625W; Tolerance: ±1%; Manufacturer Part Number: R0402_22R_1%_0.0625W_100PPM; Case: 0402; Mounted: Yes; Sense: No; Socket: No; SMD: Yes; Manufacturer1 Example: YAGEO PHYCOMP; Manufacturer1 ComponentHeight: 0.4mm; HelpURL: \\cern.ch\dfs\Applications\Altium\Datasheets\R0402_Phycomp_RC0402.pdf; Author: CERN DEM JLC; CreateDate: 03-Dec-07; LatestRevisionDate: 17-Oct-12
R93 R96 = R0402_0R_JUMPER: Resistor; Manufacturer: GENERIC; Part Description: 1A (0.05R Max DC Resistance) Zero Ohm Jumper; Manufacturer1 Part Number: 232270591001L; PressFit: No; Manufacturer Part Number: R0402_0R_JUMPER; Part Number: R0402_0R_JUMPER; Value: 0; Component Kind: Standard; Component Type: Standard; Pin Count: 2; Status: Not Recommended; Case: 0402; Mounted: Yes; Sense: No; Socket: No; SMD: Yes; Manufacturer1 Example: YAGEO PHYCOMP; Manufacturer1 ComponentHeight: 0.4mm; HelpURL: \\cern.ch\dfs\Applications\Altium\Datasheets\R0402_Phycomp_RC0402.pdf; Author: CERN DEM JLC; CreateDate: 03.12.2007; LatestRevisionDate: 17.10.2012
R95 = R0402_1K_1%_0.0625W_100PPM: Resistor - 1%; Part Description: General Purpose Thick Film Chip Resistor; Manufacturer: GENERIC; Manufacturer1 Part Number: 232270671002L; TC: ±100ppm/°C; PressFit: No; Part Number: R0402_1K_1%_0.0625W_100PPM; Component Kind: Standard; Component Type: Standard; Pin Count: 2; Value: 1k; Status: Not Recommended; Power: 0.0625W; Tolerance: ±1%; Manufacturer Part Number: R0402_1K_1%_0.0625W_100PPM; Case: 0402; Mounted: Yes; Sense: No; Socket: No; SMD: Yes; Manufacturer1 Example: YAGEO PHYCOMP; Manufacturer1 ComponentHeight: 0.4mm; HelpURL: \\cern.ch\dfs\Applications\Altium\Datasheets\R0402_Phycomp_RC0402.pdf; Author: CERN DEM JLC; CreateDate: 2007-12-03; LatestRevisionDate: 2012-10-17
R97 = R0402_10K_1%_0.0625W_100PPM: Resistor - 1%; Manufacturer: GENERIC; Part Description: General Purpose Thick Film Chip Resistor; Manufacturer1 Part Number: 232270671003L; TC: ±100ppm/°C; PressFit: No; Manufacturer Part Number: R0402_10K_1%_0.0625W_100PPM; Part Number: R0402_10K_1%_0.0625W_100PPM; Tolerance: ±1%; Value: 10k; Component Kind: Standard; Component Type: Standard; Pin Count: 2; Status: Not Recommended; Power: 0.0625W; Case: 0402; Mounted: Yes; Sense: No; Socket: No; SMD: Yes; Manufacturer1 Example: YAGEO PHYCOMP; Manufacturer1 ComponentHeight: 0.4mm; HelpURL: \\cern.ch\dfs\Applications\Altium\Datasheets\R0402_Phycomp_RC0402.pdf; Author: CERN DEM JLC; CreateDate: 03.12.2007; LatestRevisionDate: 17.10.2012
R98-R100 = R0402_2K2_1%_0.0625W_100PPM: Resistor - 1%; Part Description: General Purpose Thick Film Chip Resistor; Manufacturer: GENERIC; Manufacturer1 Part Number: 232270672202L; TC: ±100ppm/°C; PressFit: No; Part Number: R0402_2K2_1%_0.0625W_100PPM; Component Kind: Standard; Component Type: Standard; Pin Count: 2; Value: 2k2; Status: Not Recommended; Power: 0.0625W; Tolerance: ±1%; Manufacturer Part Number: R0402_2K2_1%_0.0625W_100PPM; Case: 0402; Mounted: Yes; Sense: No; Socket: No; SMD: Yes; Manufacturer1 Example: YAGEO PHYCOMP; Manufacturer1 ComponentHeight: 0.4mm; HelpURL: \\cern.ch\dfs\Applications\Altium\Datasheets\R0402_Phycomp_RC0402.pdf; Author: CERN DEM JLC; CreateDate: 03.12.2007; LatestRevisionDate: 17.10.2012; ClassName: Artix
R101 = R0402_200K_1%_0.0625W_100PPM: Resistor - 1%; Part Description: General Purpose Thick Film Chip Resistor; Manufacturer: GENERIC; Manufacturer1 Part Number: 232270672004L; TC: ±100ppm/°C; PressFit: No; Part Number: R0402_200K_1%_0.0625W_100PPM; Component Kind: Standard; Component Type: Standard; Pin Count: 2; Value: 200k; Status: Not Recommended; Power: 0.0625W; Tolerance: ±1%; Manufacturer Part Number: R0402_200K_1%_0.0625W_100PPM; Case: 0402; Mounted: Yes; Sense: No; Socket: No; SMD: Yes; Manufacturer1 Example: YAGEO PHYCOMP; Manufacturer1 ComponentHeight: 0.4mm; HelpURL: \\cern.ch\dfs\Applications\Altium\Datasheets\R0402_Phycomp_RC0402.pdf; Author: CERN DEM JLC; CreateDate: 03.12.2007; LatestRevisionDate: 17.10.2012
R104-R107 R109-R112 R114 = R0402_0R_JUMPER: Resistor; Part Description: 1A (0.05R Max DC Resistance) Zero Ohm Jumper; Manufacturer: GENERIC; Manufacturer1 Part Number: 232270591001L; PressFit: No; Part Number: R0402_0R_JUMPER; Component Kind: Standard; Component Type: Standard; Pin Count: 2; Value: 0; Status: Not Recommended; Manufacturer Part Number: R0402_0R_JUMPER; Case: 0402; Mounted: Yes; Socket: No; SMD: Yes; Manufacturer1 Example: YAGEO PHYCOMP; Manufacturer1 ComponentHeight: 0.4mm; HelpURL: \\cern.ch\dfs\Applications\Altium\Datasheets\R0402_Phycomp_RC0402.pdf; Author: CERN DEM JLC; CreateDate: 03.12.2007; LatestRevisionDate: 17.10.2012; Sense: No
R108 R113 R115 R116 = R0402_10K_1%_0.0625W_100PPM: Resistor - 1%; Part Description: General Purpose Thick Film Chip Resistor; Manufacturer: GENERIC; Manufacturer1 Part Number: 232270671003L; TC: ±100ppm/°C; Table: Resistors SMD; Part Number: R0402_10K_1%_0.0625W_100PPM; Component Kind: Standard; Component Type: Standard; Pin Count: 2; Value: 10k; Status: Not recommended; Power: 0.0625W; Tolerance: ±1%; Manufacturer Part Number: R0402_10K_1%_0.0625W_100PPM; Case: 0402; Mounted: Yes; Socket: No; SMD: Yes; Manufacturer1 Example: YAGEO PHYCOMP; Manufacturer1 ComponentHeight: 0.4mm; HelpURL: \\cern.ch\dfs\Applications\Altium\Datasheets\R0402_Phycomp_RC0402.pdf; Author: CERN DEM JLC; CreateDate: 2007-12-03; LatestRevisionDate: 2012-10-17
T4-T6 = BSH103: N-CHANNEL MOSFET WITH DIODE; Part Description: 30V 850mA N-Channel Enhancement Mode Field-Effect Transistor; Manufacturer: NEXPERIA; PressFit: No; Bonding: No; Part Number: BSH103; Component Kind: Standard; Component Type: Standard; Device: BSH103; PackageDescription: SOT23, 0.95mm Pitch; 3 Pin, 1.30mm W X 2.90mm L X 1.10mm H body, IPC Medium Density; Manufacturer Part Number: BSH103; Pin Count: 3; Case: SOT23-3; Mounted: Yes; Socket: No; SMD: Yes; Sense: No; ComponentHeight: 1.1mm; HelpURL: \\cern.ch\dfs\Applications\Altium\Datasheets\BSH103.pdf; Author: CERN DEM JLC; CreateDate: 16.03.2010; LatestRevisionDate: 20.06.2017